# Altium schematic sheet msp430.SchDoc: WULPUS PRO
size A3; DrawnBy: Sergei Vostrikov; Organization: Integrated Systems Laboratory; Revision: 1.0.0; SheetNumber: 6; SheetTotal: 8
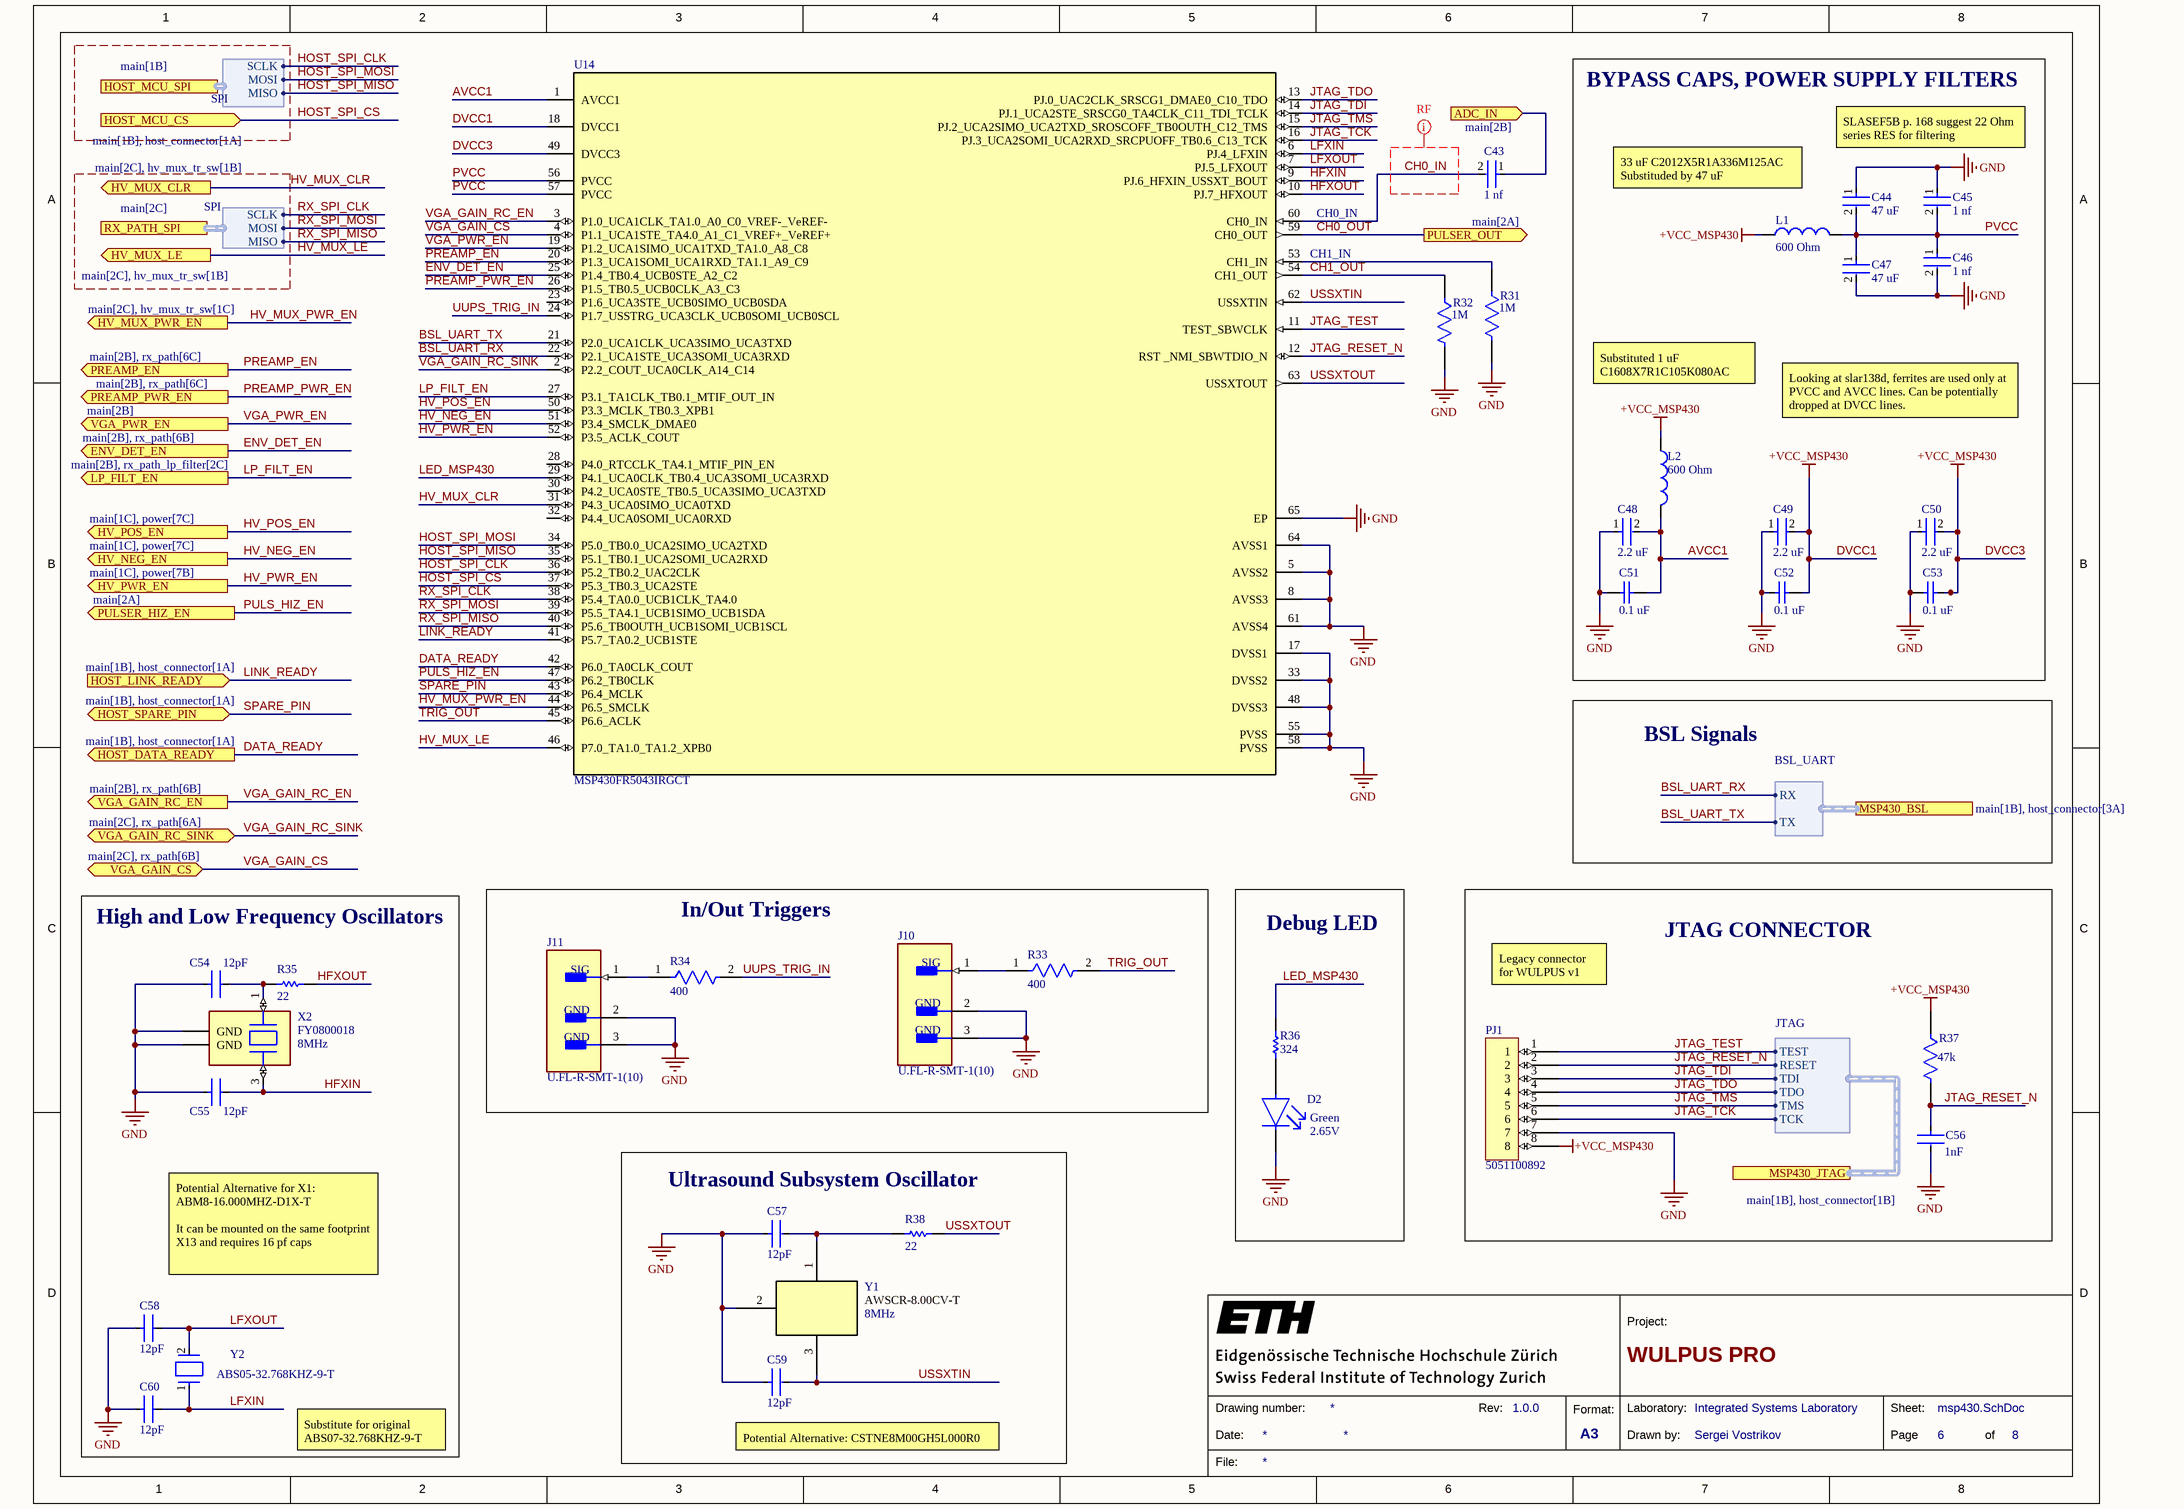
[diagram p0: msp430.SchDoc]

## Parts
C43  1 nf  [FP-GRM155-0_05-IPC_B]
C44  47 uF  [FP-GRM188-0_2-MFG]
C45  1 nf  [FP-GRM155-0_05-IPC_B]
C46  1 nf  [FP-GRM155-0_05-IPC_B]
C47  47 uF  [FP-GRM188-0_2-MFG]
C48  2.2 uF  [FP-C1005-050-0_15-0_1-MFG]
C49  2.2 uF  [FP-C1005-050-0_15-0_1-MFG]
C50  2.2 uF  [FP-C1005-050-0_15-0_1-MFG]
C51  0.1 uF  [CAPC1005X55X30LL05T10]
C52  0.1 uF  [CAPC1005X55X30LL05T10]
C53  0.1 uF  [CAPC1005X55X30LL05T10]
C54  Capacitance: 12pF  [FP-GJM155-0_05-IPC_A]  (hidden comment: GJM1555C1H120GB01D)
C55  Capacitance: 12pF  [FP-GJM155-0_05-IPC_A]  (hidden comment: GJM1555C1H120GB01D)
C56  Capacitance: 1nF  [FP-GRM155-0_05-IPC_B]  (hidden comment: GRM1555C1H102JA01D)
C57  Capacitance: 12pF  [FP-GJM155-0_05-IPC_A]  (hidden comment: GJM1555C1H120GB01D)
C58  Capacitance: 12pF  [FP-GJM155-0_05-IPC_A]  (hidden comment: GJM1555C1H120GB01D)
C59  Capacitance: 12pF  [FP-GJM155-0_05-IPC_A]  (hidden comment: GJM1555C1H120GB01D)
C60  Capacitance: 12pF  [FP-GJM155-0_05-IPC_A]  (hidden comment: GJM1555C1H120GB01D)
D2  Forward Voltage: 2.65V  Color: Green  [FP-APHD1608LZGCK-MFG]  (hidden comment: APHD1608LZGCK)
J10  U.FL-R-SMT-1(10)  [FP-U_FL-R-SMT-1_10-MFG]
J11  U.FL-R-SMT-1(10)  [FP-U_FL-R-SMT-1_10-MFG]
L1  Impedance: 600 Ohm  [SMD-0805]  (hidden comment: 742792040)
L2  Impedance: 600 Ohm  [SMD-0805]  (hidden comment: 742792040)
PJ1  5051100892  [MOLEX_5051100892]
R31  Resistance: 1M  [FP-CRCW0402-e3-MFG]  (hidden comment: CRCW04021M00FKED)
R32  Resistance: 1M  [FP-CRCW0402-e3-MFG]  (hidden comment: CRCW04021M00FKED)
R33  400  [FP-CRCW0402-C-e3-MFG]
R34  400  [FP-CRCW0402-C-e3-MFG]
R35  Resistance: 22  [RESC1005X40X25NL05T10]  (hidden comment: RC0402JR-0722RL)
R36  Resistance: 324  [RESC1005X35X20ML05T10]  (hidden comment: CPF0402B324RE1)
R37  Resistance: 47k  [FP-CRCW0402-e3-IPC_C]  (hidden comment: CRCW040247K0FKED)
R38  Resistance: 22  [RESC1005X40X25NL05T10]  (hidden comment: RC0402JR-0722RL)
U14  MSP430FR5043IRGCT  [RGC0064G]
X2  FY0800018  Frequency: 8MHz  [XTAL_ECS-80-18-30B-AGN-TR]
Y1  Frequency: 8MHz  [AWSCR-8.00CV-T_ABR]  (hidden comment: AWSCR-8.00CV-T)
Y2  ABS05-32.768KHZ-9-T  [FP-ABS05-MFG]

## Blocks framed on the sheet
BYPASS CAPS, POWER SUPPLY FILTERS: C44-C53 L1 L2
High and Low Frequency Oscillators: C54 C55 C58 C60 R35 X2 Y2
In/Out Triggers: J10 J11 R33 R34
Debug LED: D2 R36
JTAG CONNECTOR: C56 PJ1 R37
Ultrasound Subsystem Oscillator: C57 C59 R38 Y1

## Ports
ADC_IN (in, see main[2B]), ENV_DET_EN (out, see main[2B], rx_path[6B]), HOST_DATA_READY (out, see main[1B], host_connector[1A]), HOST_LINK_READY (in, see main[1B], host_connector[1A]), HOST_MCU_CS (in, see main[1B], host_connector[1A]), HOST_MCU_SPI (harness SPI, see main[1B]), HOST_SPARE_PIN (bidir, see main[1B], host_connector[1A]), HV_MUX_CLR (out, see main[2C], hv_mux_tr_sw[1B]), HV_MUX_LE (out, see main[2C], hv_mux_tr_sw[1B]), HV_MUX_PWR_EN (out, see main[2C], hv_mux_tr_sw[1C]), HV_NEG_EN (out, see main[1C], power[7C]), HV_POS_EN (out, see main[1C], power[7C]), HV_PWR_EN (out, see main[1C], power[7B]), LP_FILT_EN (out, see main[2B], rx_path_lp_filter[2C]), MSP430_BSL (harness BSL_UART, see main[1B], host_connector[3A]), MSP430_JTAG (harness JTAG, see main[1B], host_connector[1B]), PREAMP_EN (out, see main[2B], rx_path[6C]), PREAMP_PWR_EN (out, see main[2B], rx_path[6C]), PULSER_HIZ_EN (out, see main[2A]), PULSER_OUT (out, see main[2A]), RX_PATH_SPI (harness SPI, see main[2C]), VGA_GAIN_CS (bidir, see main[2C], rx_path[6B]), VGA_GAIN_RC_EN (out, see main[2B], rx_path[6B]), VGA_GAIN_RC_SINK (bidir, see main[2C], rx_path[6A]), VGA_PWR_EN (out, see main[2B])

## Harnesses
SPI: SCLK, MOSI, MISO
JTAG: TEST, RESET, TDI, TDO, TMS, TCK
BSL_UART: TX, RX

## Nets
DVCC1: C49.2 C50.2 C52.1 C53.1 L1.1 L2.1 PJ1.8 R37.1 U14.18(DVCC1) U14.49(DVCC3)  [also labelled +VCC_MSP430, DVCC3]
GND: C44.1 C45.1 C46.2 C47.2 C48.1 C49.1 C50.1 C51.2 C52.2 C53.2 C54.1 C55.1 C56.2 C57.1 C58.1 C59.1 C60.1 D2.1(C) J10.2(GND) J10.3(GND) J11.2(GND) J11.3(GND) PJ1.7 R31.2 R32.2 U14.5(AVSS2) U14.8(AVSS3) U14.17(DVSS1) U14.33(DVSS2) U14.48(DVSS3) U14.55(PVSS) U14.58(PVSS) U14.61(AVSS4) U14.64(AVSS1) U14.65(EP) X2.2(GND) X2.4(GND) Y1.2
ADC_IN: C43.1 ; port ADC_IN
AVCC1: C48.2 C51.1 L2.2 U14.1(AVCC1)
BSL_UART_RX: U14.22(P2.1_UCA1STE_UCA3SOMI_UCA3RXD) ; port MSP430_BSL.RX
BSL_UART_TX: U14.21(P2.0_UCA1CLK_UCA3SIMO_UCA3TXD) ; port MSP430_BSL.TX
CH0_IN: C43.2 U14.60(CH0_IN)
CH0_OUT: U14.59(CH0_OUT) ; port PULSER_OUT
CH1_OUT: R32.1 U14.54(CH1_OUT)
DATA_READY: U14.42(P6.0_TA0CLK_COUT) ; port HOST_DATA_READY
ENV_DET_EN: U14.25(P1.4_TB0.4_UCB0STE_A2_C2) ; port ENV_DET_EN
HFXIN: C55.2 U14.9(PJ.6_HFXIN_USSXT_BOUT) X2.3(OUT/IN)
HFXOUT: R35.2 U14.10(PJ.7_HFXOUT)
HOST_SPI_CLK: U14.36(P5.2_TB0.2_UAC2CLK) ; port HOST_MCU_SPI.SCLK
HOST_SPI_CS: U14.37(P5.3_TB0.3_UCA2STE) ; port HOST_MCU_CS
HOST_SPI_MISO: U14.35(P5.1_TB0.1_UCA2SOMI_UCA2RXD) ; port HOST_MCU_SPI.MISO
HOST_SPI_MOSI: U14.34(P5.0_TB0.0_UCA2SIMO_UCA2TXD) ; port HOST_MCU_SPI.MOSI
HV_MUX_CLR: U14.31(P4.3_UCA0SIMO_UCA0TXD) ; port HV_MUX_CLR
HV_MUX_LE: U14.46(P7.0_TA1.0_TA1.2_XPB0) ; port HV_MUX_LE
HV_MUX_PWR_EN: U14.44(P6.5_SMCLK) ; port HV_MUX_PWR_EN
HV_NEG_EN: U14.51(P3.4_SMCLK_DMAE0) ; port HV_NEG_EN
HV_POS_EN: U14.50(P3.3_MCLK_TB0.3_XPB1) ; port HV_POS_EN
HV_PWR_EN: U14.52(P3.5_ACLK_COUT) ; port HV_PWR_EN
JTAG_RESET_N: C56.1 PJ1.2 R37.2 U14.12(RST__NMI_SBWTDIO_N) ; port MSP430_JTAG.RESET
JTAG_TCK: PJ1.6 U14.16(PJ.3_UCA2SOMI_UCA2RXD_SRCPUOFF_TB0.6_C13_TCK) ; port MSP430_JTAG.TCK
JTAG_TDI: PJ1.3 U14.14(PJ.1_UCA2STE_SRSCG0_TA4CLK_C11_TDI_TCLK) ; port MSP430_JTAG.TDI
JTAG_TDO: PJ1.4 U14.13(PJ.0_UAC2CLK_SRSCG1_DMAE0_C10_TDO) ; port MSP430_JTAG.TDO
JTAG_TEST: PJ1.1 U14.11(TEST_SBWCLK) ; port MSP430_JTAG.TEST
JTAG_TMS: PJ1.5 U14.15(PJ.2_UCA2SIMO_UCA2TXD_SROSCOFF_TB0OUTH_C12_TMS) ; port MSP430_JTAG.TMS
LED_MSP430: R36.1 U14.29(P4.1_UCA0CLK_TB0.4_UCA3SOMI_UCA3RXD)
LFXIN: C60.2 U14.6(PJ.4_LFXIN) Y2.1
LFXOUT: C58.2 U14.7(PJ.5_LFXOUT) Y2.2
LINK_READY: U14.41(P5.7_TA0.2_UCB1STE) ; port HOST_LINK_READY
LP_FILT_EN: U14.27(P3.1_TA1CLK_TB0.1_MTIF_OUT_IN) ; port LP_FILT_EN
PREAMP_EN: U14.20(P1.3_UCA1SOMI_UCA1RXD_TA1.1_A9_C9) ; port PREAMP_EN
PREAMP_PWR_EN: U14.26(P1.5_TB0.5_UCB0CLK_A3_C3) ; port PREAMP_PWR_EN
PULS_HIZ_EN: U14.47(P6.2_TB0CLK) ; port PULSER_HIZ_EN
PVCC: C44.2 C45.2 C46.1 C47.1 L1.2 U14.56(PVCC) U14.57(PVCC)
RX_SPI_CLK: U14.38(P5.4_TA0.0_UCB1CLK_TA4.0) ; port RX_PATH_SPI.SCLK
RX_SPI_MISO: U14.40(P5.6_TB0OUTH_UCB1SOMI_UCB1SCL) ; port RX_PATH_SPI.MISO
RX_SPI_MOSI: U14.39(P5.5_TA4.1_UCB1SIMO_UCB1SDA) ; port RX_PATH_SPI.MOSI
SPARE_PIN: U14.43(P6.4_MCLK) ; port HOST_SPARE_PIN
TRIG_OUT: R33.2 U14.45(P6.6_ACLK)
USSXTIN: C59.2 U14.62(USSXTIN) Y1.3
USSXTOUT: R38.2 U14.63(USSXTOUT)
UUPS_TRIG_IN: R34.2 U14.24(P1.7_USSTRG_UCA3CLK_UCB0SOMI_UCB0SCL)
VGA_GAIN_CS: U14.4(P1.1_UCA1STE_TA4.0_A1_C1_VREF+_VeREF+) ; port VGA_GAIN_CS
VGA_GAIN_RC_EN: U14.3(P1.0_UCA1CLK_TA1.0_A0_C0_VREF-_VeREF-) ; port VGA_GAIN_RC_EN
VGA_GAIN_RC_SINK: U14.2(P2.2_COUT_UCA0CLK_A14_C14) ; port VGA_GAIN_RC_SINK
VGA_PWR_EN: U14.19(P1.2_UCA1SIMO_UCA1TXD_TA1.0_A8_C8) ; port VGA_PWR_EN
NetC54_2: C54.2 R35.1 X2.1(IN/OUT)
NetC57_2: C57.2 R38.1 Y1.1
NetD2_2: D2.2(A) R36.2
NetJ10_1: J10.1(SIG) R33.1
NetJ11_1: J11.1(SIG) R34.1
NetR31_1: R31.1 U14.53(CH1_IN)

Not connected (* = marked no-connect by the designer): U14 23(P1.6_UCA3STE_UCB0SIMO_UCB0SDA) 28(P4.0_RTCCLK_TA4.1_MTIF_PIN_EN) 30(P4.2_UCA0STE_TB0.5_UCA3SIMO_UCA3TXD) 32(P4.4_UCA0SOMI_UCA0RXD)

## Layout directives
net class RF: CH0_IN

## Notes on the sheet
- 33 uF C2012X5R1A336M125AC Substituded by 47 uF
- SLASEF5B p. 168 suggest 22 Ohm series RES for filtering
- (near U14) CH0_IN
- (near U14) CH1_IN
- Substituted 1 uF C1608X7R1C105K080AC
- Looking at slar138d, ferrites are used only at PVCC and AVCC lines. Can be potentially dropped at DVCC lines.
- BSL Signals
- Legacy connector for WULPUS v1
- Potential Alternative for X1:
  ABM8-16.000MHZ-D1X-T
  It can be mounted on the same footprint X13 and requires 16 pf caps
- Substitute for original ABS07-32.768KHZ-9-T
- (near C59) Potential Alternative: CSTNE8M00GH5L000R0
- 1
- 2
- 3
- 4
- 5
- 6
- 7
- 8
- A
- B
- C
- D
- Project:
- Date:
- Drawing number:
- Rev:
- Format:
- A3
- Drawn by:
- Laboratory:
- Page
- Sheet:
- of
- File:

## Library data of the parts
C43 C45 C46 = CMP-2008-04254-2: GRM1555C1H102JA01D; Tolerance: 5%; Temperature Coefficient: 30ppm/°C; Insulation Resistance: 10GR; Material: Ceramic; Voltage Rating: 50V; Dielectric: C0G; Capacitance: 1nF; Packaging: Tape and Reel; Lead Free: Lead Free; Thickness: 0.022inch; Termination: SMD/SMT; Max Operating Temperature: 125°C; Height: 0.5mm; Package Quantity: 1; Radiation Hardening: No; Case Code (Metric): 1005; Number of Pins: 2; Mount: Surface Mount; Voltage: 50V; Case/Package: 0402; Min Operating Temperature: -55°C; Dielectric Material: Ceramic; Width: 0.5mm; Depth: 0.5mm; Case Code (Imperial): 0402; REACH SVHC: No SVHC; Voltage Rating (DC): 50V; Length: 1mm
C44 C47 = CMP-00260-117335223-1: GRM188R60J476ME01D; Material: Ceramic; Tolerance: 20%; Voltage Rating (DC): 6.3V; Dielectric: X5R; Capacitance: 47µF; Case/Package: 0603; Width: 800µm; Min Operating Temperature: -55°C; Lifecycle Status: Production; Height: 1mm; Length: 1.6mm; Max Operating Temperature: 85°C; Voltage Rating: 6.3V; NexarPartId: 117335223; Thickness: 800µm
C48-C50 = CMP-08246-004344-1: C1005X7S1A225K050BC; Capacitance: 2.2uF; Dielectric: X7S; Dielectric Material: Ceramic; Voltage Rating: 10V; Tolerance: 10%; Mount: Surface Mount; Height: 0.5mm; Package Quantity: 1; Depth: 0.5mm; RoHS Compliant: Yes; Length: 1mm; Thickness: 0.022inch; Packaging: Tape and Reel; Case Code (Imperial): 0402; Resistor Type: Ceramic; Case/Package: 0402; Min Operating Temperature: -55°C; Series: C; Weight: 2.3E-05oz; Width: 0.02inch; Voltage Rating (DC): 10V; Case Code (Metric): 1005; Max Operating Temperature: 125°C; Termination: SMD/SMT; Lead Free: Lead Free
C51-C53 = CMP-0001-00074-2: C0402C104K4RACTU; Manufacturer: Kemet; Part Number: C0402C104K4RACTU
C54 C55 C57-C60 = CMP-2008-03799-2: Multi-Layer Ceramic Capacitor 12pF C0G  ±2% 0402 Paper T/R; Voltage Rating: 50V; Tolerance: 2%; Length: 1mm; Width: 0.5mm; Thickness: 0.022inch; Package Quantity: 10000; Lead Free: Lead Free; Mount: Surface Mount; Voltage Rating (DC): 50V; Max Operating Temperature: 125°C; Termination: SMD/SMT; Depth: 0.5mm; Min Operating Temperature: -55°C; Height: 0.5mm; Case Code (Imperial): 0402; Case/Package: 0402; Case Code (Metric): 1005; Dielectric: C0G; Packaging: Tape and Reel; Radiation Hardening: No
C56 = CMP-2008-04254-2: Chip Multilayer Ceramic Capacitors for General Purpose, 0402, 1000pF, C0G, 30ppm/°C, 5%, 50V; Insulation Resistance: 10GR; Packaging: Tape and Reel; Lead Free: Lead Free; Tolerance: 5%; Temperature Coefficient: 30ppm/°C; Thickness: 0.022inch; Termination: SMD/SMT; Max Operating Temperature: 125°C; Height: 0.5mm; Package Quantity: 1; Radiation Hardening: No; Material: Ceramic; Case Code (Metric): 1005; Number of Pins: 2; Voltage Rating: 50V; Mount: Surface Mount; Voltage: 50V; Case/Package: 0402; Min Operating Temperature: -55°C; Dielectric Material: Ceramic; Width: 0.5mm; Depth: 0.5mm; Case Code (Imperial): 0402; REACH SVHC: No SVHC; Dielectric: C0G; Voltage Rating (DC): 50V; Length: 1mm
D2 = CMP-44529-000045-1: LED GREEN CLEAR 1608 SMD; Test Current: 2mA; Dominant Wavelength: 525nm; Lens Color: Colorless; Luminous Intensity: 180mcd; Viewing Angle: 100°; Lens Size: 0.7mm; Lens Style: Round; Mount: Surface Mount; Packaging: Tape and Reel; Lens Transparency: Clear; Height: 0.75mm; Case/Package: 0603; Length: 1.6mm; Case Code (Metric): 1608; Width: 0.8mm; Case Code (Imperial): 0603
J10 J11 = CMP-2000-05152-3: CONN U.FL RCPT STR 50 OHM SMD; Max Frequency: 6GHz; Connector Type: Coaxial; Body Plating: Silver; Body Material: Bronze; Impedance: 50R; Dielectric Material: Polymer; Insulation Resistance: 500MR; Gender: Male; Packaging: Cut Tape; Length: 3mm; Package Quantity: 2500; Termination: Solder; Lead Free: Lead Free; Series: U.FL; Min Operating Temperature: -40°C; Fastening Type: Snap; Contact Material: Brass; Orientation: Straight; Wire/Cable Type: Coaxial; Frequency: 6GHz; Contact Plating: Gold; Depth: 3.1mm; Weight: 0.001764oz; Max Operating Temperature: 90°C; Radiation Hardening: No; REACH SVHC: No SVHC; Mount: Surface Mount; Housing Color: Beige
L1 L2 = CMP-0220-00032-1: SMD EMI Suppression Ferrite Bead WE-CBF, Z = 600 Ohm; PackageVersion: 2005; ComponentLink2Description: Datasheet; PackageDescription: Chip Inductor, 2-Leads, Body 2.0 x 1.2 mm; ComponentLink1URL: http://www.we-online.com; PackageReference: SMD-0805; DatasheetVersion: Dec-2005; ComponentLink2URL: http://www.we-online.de/katalog/media/pdf/742792040.pdf; ComponentLink1Description: Manufacturer Link
PJ1 = MOLEX_5051100892
R31 R32 = CMP-2002-08314-2: RES Thick Film, 1MΩ, 1%, 0.063W, 100ppm/°C, 0402; Power Rating: 63mW; Voltage Rating (DC): 50V; Min Operating Temperature: -55°C; Lead Free: Lead Free; Case Code (Imperial): 0402; Packaging: Tape and Reel; Case Code (Metric): 1005; Tolerance: 1%; Number of Terminations: 2; Features: Automotive AEC-Q200; Number of Pins: 2; Max Power Dissipation: 63mW; Height: 0.35mm; Weight: 2.3E-05oz; Package Quantity: 10; Contact Plating: Tin; Temperature Coefficient: 100ppm/°C; Radiation Hardening: No; Length: 1mm; Termination: SMD/SMT; Depth: 0.5mm; Case/Package: 0402; Voltage Rating: 50V; Composition: Thick Film; Width: 0.02inch; Max Operating Temperature: 155°C; Military Standard: Not
R33 R34 = CMP-00030-23798141-1: CRCW04021R00FKEDC; Resistance: 1Ω; Tolerance: 1%; Temperature Coefficient: 100ppm/°C; Voltage Rating: 50V; Power Rating: 63mW; Lead Free: Lead Free; Case/Package: 0402; Max Operating Temperature: 155°C; RoHS: Compliant; Height: 350µm; Schedule B: 8533210045, 8533210045; Composition: Thick Film; NexarPartId: 23798141; Min Operating Temperature: -55°C
R35 R38 = CMP-2002-07961-1: Manufacturer: Yageo / Phycomp; Part Number: RC0402JR-0722RL
R36 = CMP-2002-03257-1: Manufacturer: TE Connectivity / AMP; Part Number: CPF0402B324RE1
R37 = CMP-02407-007705-1: RES Thick Film, 47kΩ, 1%, 0.063W, 100ppm/°C, 0402; Voltage Rating (DC): 50V; Power Rating: 63mW; Temperature Coefficient: 100ppm/°C; Mount: Surface Mount; Radiation Hardening: No; Case Code (Imperial): 0402; Case Code (Metric): 1005; Contact Plating: Tin; Case/Package: 0402; Package Quantity: 10000; Width: 0.5mm; Lead Free: Lead Free; Packaging: Tape and Reel; Length: 1mm; Max Operating Temperature: 155°C; Min Operating Temperature: -55°C; Tolerance: 1%; Weight: 2.3E-05oz; Working Voltage: 50V; Voltage Rating: 50V; Height: 0.35mm; Depth: 0.5mm; Composition: Thick Film; Number of Terminations: 2; Termination: SMD/SMT; Military Standard: Not
U14 = MSP430FR5043IRGCT: No Description Available; Mfr_Name: Texas Instruments; Type: DEV; RefDes: RefDes; Copyright: Copyright (C) 2021 Ultra Librarian. All rights reserved.; Manufacturer_Part_Number: MSP430FR5043IRGCT
X2 = FY0800018: Crystal 8MHz ±30ppm (Tol) ±30ppm (Stability) 18pF FUND 100Ohm 4-Pin SMD T/R; Manufacturer: Diodes; ESR (Equivalent Series Resistance): 100R; Supplier 1: Digi-Key; Manufacturer Part Number: FY0800018; RoHS: Yes; Category: Crystals; Stock 1: 10869; Pricing 1: 1=0.80000, 10=0.70800, 50=0.66220, 100=0.58520, 500=0.55440 (USD); Mount: Surface Mount; Case/Package: SMD/SMT; Min Operating Temperature: -40°C; Max Operating Temperature: 85°C; Packaging: Cut Tape; Frequency Stability: 30ppm; Frequency Tolerance: 30ppm; Load Capacitance: 18pF; Length: 0.197inch; Width: 0.126inch; Height: 0.043inch; ComponentLink1URL: http://media.digikey.com/pdf/Data%20Sheets/Pericom%20PDFs/FY0800018_VerB.pdf?src-supplier=Digi-Key; ComponentLink1Description: http://media.digikey.com/pdf/Data%20Sheets/Pericom%20PDFs/FY0800018_VerB.pdf?src-supplier=Digi-Key; Supplier Part Number 1: FY0800018CT-ND
Y1 = AWSCR-8.00CV-T: No Description Available; Mfr_Name: Abracon; Copyright: Copyright (C) 2021 Ultra Librarian. All rights reserved.; RefDes: RefDes; Type: DEV; Manufacturer_Part_Number: AWSCR-8.00CV-T
Y2 = CMP-27762-000002-3: CRYSTAL 32.7680KHZ 9PF SMD; Tolerance: 20ppm; Series Resistance: 90kR; Series: ABS05; Frequency: 32.768kHz; Radiation Hardening: No; Min Operating Temperature: -40°C; RoHS Compliant: Yes; Termination: SMD/SMT; Max Operating Temperature: 85°C; Depth: 1mm; Load Capacitance: 9pF; Number of Pins: 2; Frequency Tolerance: 20ppm; Package Quantity: 3000; Operating Frequency: 32.768 kHz; Case/Package: CSMD; Height: 0.5mm; Length: 1.6mm; REACH SVHC: No SVHC; Packaging: Tape and Reel; ESR (Equivalent Series Resistance): 90kR; Mount: Surface Mount; Lead Free: Lead Free; Width: 1mm